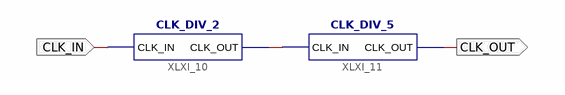
[diagram p0: schematic sheet 1]
// Xilinx ISE schematic CLK_DIV_10.sch (spartan6) as structural Verilog: 2 symbols, 2 ports
module CLK_DIV_10 (
  input  CLK_IN,
  output CLK_OUT
);

  wire XLXN_35;

  CLK_DIV_2 XLXI_10 (.CLK_IN(CLK_IN), .CLK_OUT(XLXN_35));
  CLK_DIV_5 XLXI_11 (.CLK_IN(XLXN_35), .CLK_OUT(CLK_OUT));
endmodule
